# Altium schematic sheet Sheet1.SchDoc
size A4; SheetNumber: 1; SheetTotal: 4
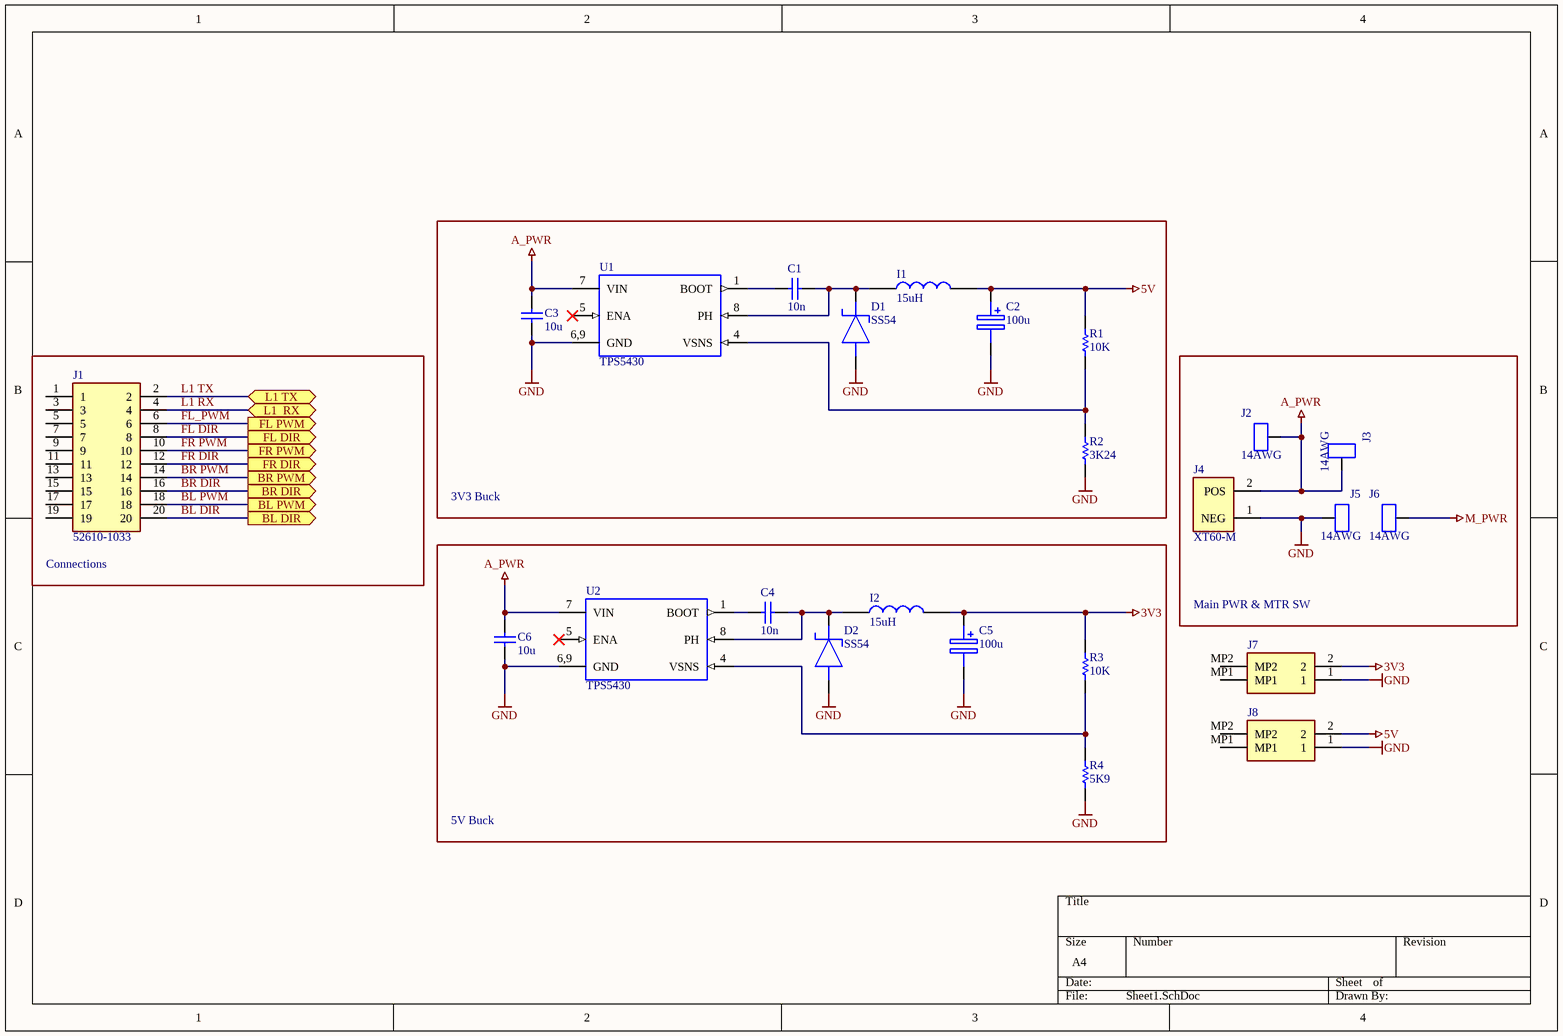
[diagram p0: Sheet1.SchDoc]

## Parts
C1  10n  [CAP0603]
C2  100u  [CAP7343]
C3  10u  [CAP0603]
C4  10n  [CAP0603]
C5  100u  [CAP7343]
C6  10u  [CAP0603]
D1  SS54  [SMDSC]
D2  SS54  [SMDSC]
I1  15uH  [SWPA8040]
I2  15uH  [SWPA8040]
J1  52610-1033  [526101033]
J2  14AWG  [14AWG]
J3  14AWG  [14AWG]
J4  XT60-M  [AMASS_XT60-M]
J5  14AWG  [14AWG]
J6  14AWG  [14AWG]
J7  BM02B-SRSS-TB_LF__SN_  [BM02BSRSSTBLFSN]  (value not drawn)
J8  BM02B-SRSS-TB_LF__SN_  [BM02BSRSSTBLFSN]  (value not drawn)
R1  10K  [RES0603]
R2  3K24  [RES0603]
R3  10K  [RES0603]
R4  5K9  [RES0603]
U1  TPS5430  [FP-DDA0008J-MFG]
U2  TPS5430  [FP-DDA0008J-MFG]

## Blocks framed on the sheet
3V3 Buck: C1-C3 D1 I1 R1 R2 U1
Connections: J1
Main PWR & MTR SW: J2-J6
5V Buck: C4-C6 D2 I2 R3 R4 U2

## Ports
BL DIR (out), BL PWM (out), BR DIR (out), BR PWM (out), FL DIR (out), FL PWM (out), FR DIR (out), FR PWM (out), L1  RX (bidir), L1 TX (bidir)

## Nets
3V3: C5.1(+) I2.2 J7.2 R3.1
5V: C2.1(+) I1.2 J8.2 R1.1
A_PWR: C3.2 C6.2 J2.1 J3.1 J4.2(POS) U1.7(VIN) U2.7(VIN)
GND: C2.2(-) C3.1 C5.2(-) C6.1 D1.2(A) D2.2(A) J4.1(NEG) J5.1 J7.1 J8.1 R2.2 R4.2 U1.6,9(GND) U2.6,9(GND)
M_PWR: J6.1
BL DIR: J1.20 ; port BL DIR
BL PWM: J1.18 ; port BL PWM
BR DIR: J1.16 ; port BR DIR
BR PWM: J1.14 ; port BR PWM
FL DIR: J1.8 ; port FL DIR
FL_PWM: J1.6 ; port FL PWM
FR DIR: J1.12 ; port FR DIR
FR PWM: J1.10 ; port FR PWM
L1 RX: J1.4 ; port L1  RX
L1 TX: J1.2 ; port L1 TX
NetC1_1: C1.1 D1.1(K) I1.1 U1.8(PH)
NetC1_2: C1.2 U1.1(BOOT)
NetC4_1: C4.1 D2.1(K) I2.1 U2.8(PH)
NetC4_2: C4.2 U2.1(BOOT)
NetR1_2: R1.2 R2.1 U1.4(VSNS)
NetR3_2: R3.2 R4.1 U2.4(VSNS)

Not connected (* = marked no-connect by the designer): J1 1 3 5 7 9 11 13 15 17 19; J7 MP1 MP2; J8 MP1 MP2; U1 5(ENA)*; U2 5(ENA)*

## Library data of the parts
C1 C3 C4 C6 = CAP0603: 0603 Capacitor
C2 C5 = EIA7343: 25V 100UF ±20%; Value: 100u
D1 D2 = Schotty Diode: SMD Schotty Diode
I1 I2 = SWPA8040: 10uH INDUCTOR
J1 = 52610-1033: Connector; Manufacturer_Name: Molex; Datasheet Link: https://www.mouser.com/datasheet/2/276/0526101033_FFC_FPC_CONNECTORS-294979.pdf; Height: 7.45mm; Manufacturer_Part_Number: 52610-1033; Mouser Part Number: 538-52610-1033; Mouser Price/Stock: https://www.mouser.co.uk/ProductDetail/Molex/52610-1033?qs=rw2VfpiI%2FsPpjB%252BOP20huA%3D%3D
J4 = CMP-062-000000-4: Plug; DC supply; XT60; male; PIN: 2; for cable; soldered; 30A; 500V; MF: AMASS; SnapEDA_Link: https://www.snapeda.com/parts/XT60-M/AMASS/view-part/2883912/?ref=snap; Design Item ID: XT60-M; Price: None; Availability: Unavailable; Source: SnapEDAsch.SchLib; Component Type: Standard; Package: Package Analog Devices; MP: XT60-M; Pin Count: 2; Value: *
J7 J8 = BM02B-SRSS-TB_LF__SN_: Connector; Manufacturer_Name: JST (JAPAN SOLDERLESS TERMINALS); Manufacturer_Part_Number: BM02B-SRSS-TB(LF)(SN); Datasheet Link: http://www.jst-mfg.com/product/pdf/eng/eSR.pdf; Height: 4.25mm; Arrow Part Number: BM02B-SRSS-TB(LF)(SN); Arrow Price/Stock: https://www.arrow.com/en/products/bm02b-srss-tb-lf-sn/jst-manufacturing?region=europe
R1-R4 = RES0603: Resistor
U1 U2 = TPS5430: TPS5430 3-A, Wide Input Range, Step-Down Converter